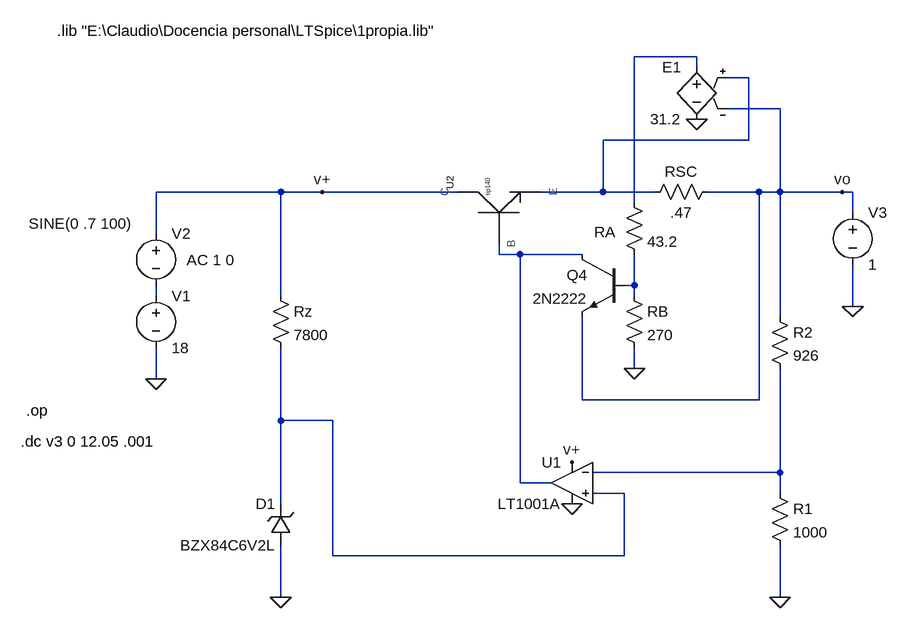
[diagram p0: schematic regulador5.asc]
regulador5.asc, the LTspice schematic file:
Version 4
SHEET 1 1316 680
WIRE 864 -256 768 -256
WIRE 864 -240 864 -256
WIRE 944 -224 912 -224
WIRE 992 -176 912 -176
WIRE 944 -128 944 -224
WIRE 944 -128 720 -128
WIRE 224 -48 32 -48
WIRE 288 -48 224 -48
WIRE 496 -48 288 -48
WIRE 720 -48 720 -128
WIRE 720 -48 624 -48
WIRE 800 -48 720 -48
WIRE 960 -48 880 -48
WIRE 992 -48 992 -176
WIRE 992 -48 960 -48
WIRE 1088 -48 992 -48
WIRE 1104 -48 1088 -48
WIRE 768 -32 768 -256
WIRE 1104 -16 1104 -48
WIRE 32 16 32 -48
WIRE 560 48 560 32
WIRE 592 48 560 48
WIRE 688 48 592 48
WIRE 768 96 768 48
WIRE 768 96 752 96
WIRE 32 112 32 96
WIRE 224 112 224 -48
WIRE 768 112 768 96
WIRE 1104 128 1104 64
WIRE 992 144 992 -48
WIRE 768 224 768 192
WIRE 32 240 32 192
WIRE 688 272 688 144
WIRE 960 272 960 -48
WIRE 960 272 688 272
WIRE 224 304 224 192
WIRE 304 304 224 304
WIRE 992 384 992 224
WIRE 992 384 704 384
WIRE 592 400 592 48
WIRE 640 400 592 400
WIRE 752 416 704 416
WIRE 992 416 992 384
WIRE 224 432 224 304
WIRE 304 512 304 304
WIRE 752 512 752 416
WIRE 752 512 304 512
WIRE 224 576 224 496
WIRE 992 576 992 496
FLAG 32 240 0
FLAG 224 576 0
FLAG 992 576 0
FLAG 1104 128 0
FLAG 1088 -48 vo
FLAG 768 224 0
FLAG 288 -48 v+
FLAG 672 368 v+
FLAG 672 432 0
FLAG 864 -160 0
DATAFLAG 992 -48 ""
DATAFLAG 992 304 ""
DATAFLAG 224 304 ""
DATAFLAG 592 240 ""
SYMBOL voltage 32 96 R0
WINDOW 123 0 0 Left 2
WINDOW 39 0 0 Left 2
SYMATTR InstName V1
SYMATTR Value 18
SYMBOL voltage 32 0 R0
WINDOW 123 47 57 Left 2
WINDOW 39 0 0 Left 2
WINDOW 3 -196 1 Left 2
SYMATTR Value2 AC 1 0
SYMATTR Value SINE(0 .7 100)
SYMATTR InstName V2
SYMBOL res 208 96 R0
SYMATTR InstName Rz
SYMATTR Value 7800
SYMBOL zener 240 496 R180
WINDOW 0 24 64 Left 2
WINDOW 3 24 0 Left 2
SYMATTR InstName D1
SYMATTR Value BZX84C6V2L
SYMATTR Description Diode
SYMATTR Type diode
SYMBOL res 976 128 R0
SYMATTR InstName R2
SYMATTR Value 926
SYMBOL res 976 400 R0
SYMATTR InstName R1
SYMATTR Value 1000
SYMBOL npn 752 48 M0
SYMATTR InstName Q4
SYMATTR Value 2N2222
SYMBOL res 896 -64 R90
WINDOW 0 0 56 VBottom 2
WINDOW 3 32 56 VTop 2
SYMATTR InstName RSC
SYMATTR Value .47
SYMBOL res 752 -48 R0
WINDOW 0 -46 62 Left 2
SYMATTR InstName RA
SYMATTR Value 43.2
SYMBOL res 752 96 R0
SYMATTR InstName RB
SYMATTR Value 270
SYMBOL OpAmps\\LT1001A 672 336 M0
SYMATTR InstName U1
SYMBOL Propia\\Darlington\ npn 560 -16 R270
SYMATTR Value tip140
SYMATTR InstName U2
SYMBOL voltage 1104 -32 R0
WINDOW 123 0 0 Left 0
WINDOW 39 0 0 Left 0
SYMATTR InstName V3
SYMATTR Value 1
SYMBOL e 864 -256 M0
SYMATTR InstName E1
SYMATTR Value 31.2
TEXT -168 288 Left 2 !.op
TEXT -176 336 Left 2 !.dc v3 0 12.05 .001
TEXT -120 -296 Left 2 !.lib "E:\\Claudio\\Docencia personal\\LTSpice\\1propia.lib"

The netlist it stands for:
* regulador5.asc
V1 N005 0 18
V2 v+ N005 SINE(0 .7 100) AC 1 0
Rz v+ N006 7800
D1 0 N006 BZX84C6V2L
R2 vo N007 926
R1 N007 0 1000
Q4 N003 N004 vo 0 2N2222
RSC vo N002 .47
RA N001 N004 43.2
RB N004 0 270
XU1 N006 N007 v+ 0 N003 LT1001  ; LT1001A, pins In+ In- V+ V- OUT
XU2 v+ N003 N002 tip140  ; pins C B E
V3 vo 0 1
E1 N001 0 N002 vo 31.2
.model D D
.lib standard.dio
.model NPN NPN
.model PNP PNP
.lib standard.bjt
.op
.dc v3 0 12.05 .001
.lib "E:\Claudio\Docencia personal\LTSpice\1propia.lib"
.lib LTC.lib
.backanno
.end